# EAGLE schematic MainPCB_v0 (EAGLE 9.2.2)
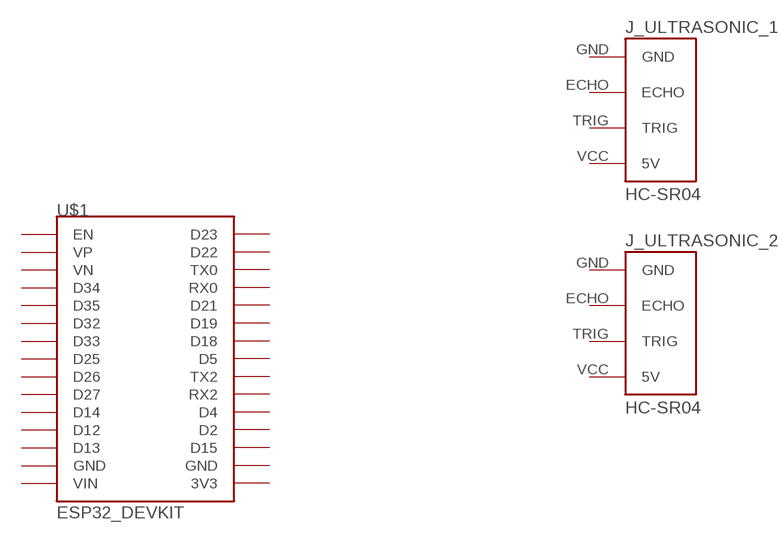
[diagram p0: schematic, sheet 1]

## Parts
J_ULTRASONIC_1  HC-SR04  [HC-SR04_FOOTPRINT]
J_ULTRASONIC_2  HC-SR04  [HC-SR04_FOOTPRINT]
U$1  ESP32_DEVKIT  [ESP32_DEVKIT]
Unconnected: J_ULTRASONIC_1.ECHO J_ULTRASONIC_1.GND J_ULTRASONIC_1.TRIG J_ULTRASONIC_1.VCC(5V) J_ULTRASONIC_2.ECHO J_ULTRASONIC_2.GND J_ULTRASONIC_2.TRIG J_ULTRASONIC_2.VCC(5V) U$1.3V3 U$1.D2 U$1.D4 U$1.D5 U$1.D12 U$1.D13 U$1.D14 U$1.D15 U$1.D18 U$1.D19 U$1.D21 U$1.D22 U$1.D23 U$1.D25 U$1.D26 U$1.D27 U$1.D32 U$1.D33 U$1.D34 U$1.D35 U$1.EN U$1.GND@1(GND) U$1.GND@2(GND) U$1.RX0 U$1.RX2 U$1.TX0 U$1.TX2 U$1.VIN U$1.VN U$1.VP

## Library data of the parts
J_ULTRASONIC_1 J_ULTRASONIC_2 = hcsr04:HC-SR04: Ultrasonic Sensor HC-SR04
U$1 = NodeMCU-Esp32-s:ESP32_DEVKIT: ESP32 DEVKIT BOARD